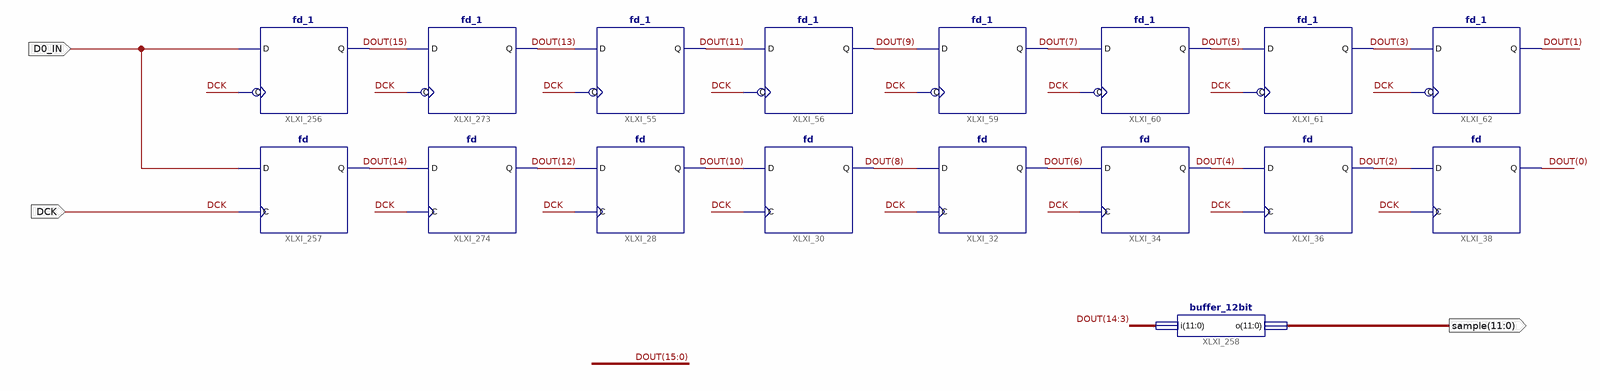
[diagram p0: schematic sheet 1]
// Xilinx ISE schematic ADC_block_14d.sch (virtex4) as structural Verilog: 17 symbols, 3 ports
module ADC_block_14d (
  input  DCK,
  input  D0_IN,
  output [11:0] sample
);

  wire [15:0] DOUT;

  buffer_12bit XLXI_258 (.i(DOUT[14:3]), .o(sample));
  fd_1 XLXI_256 (.C(DCK), .D(D0_IN), .Q(DOUT[15]));
  fd XLXI_257 (.C(DCK), .D(D0_IN), .Q(DOUT[14]));
  fd XLXI_38 (.C(DCK), .D(DOUT[2]), .Q(DOUT[0]));
  fd_1 XLXI_62 (.C(DCK), .D(DOUT[3]), .Q(DOUT[1]));
  fd_1 XLXI_61 (.C(DCK), .D(DOUT[5]), .Q(DOUT[3]));
  fd_1 XLXI_60 (.C(DCK), .D(DOUT[7]), .Q(DOUT[5]));
  fd_1 XLXI_59 (.C(DCK), .D(DOUT[9]), .Q(DOUT[7]));
  fd_1 XLXI_56 (.C(DCK), .D(DOUT[11]), .Q(DOUT[9]));
  fd_1 XLXI_55 (.C(DCK), .D(DOUT[13]), .Q(DOUT[11]));
  fd XLXI_36 (.C(DCK), .D(DOUT[4]), .Q(DOUT[2]));
  fd XLXI_34 (.C(DCK), .D(DOUT[6]), .Q(DOUT[4]));
  fd XLXI_32 (.C(DCK), .D(DOUT[8]), .Q(DOUT[6]));
  fd XLXI_30 (.C(DCK), .D(DOUT[10]), .Q(DOUT[8]));
  fd XLXI_28 (.C(DCK), .D(DOUT[12]), .Q(DOUT[10]));
  fd_1 XLXI_273 (.C(DCK), .D(DOUT[15]), .Q(DOUT[13]));
  fd XLXI_274 (.C(DCK), .D(DOUT[14]), .Q(DOUT[12]));
endmodule
